# Altium schematic sheet 01_Power.SchDoc
size A3; Revision: A
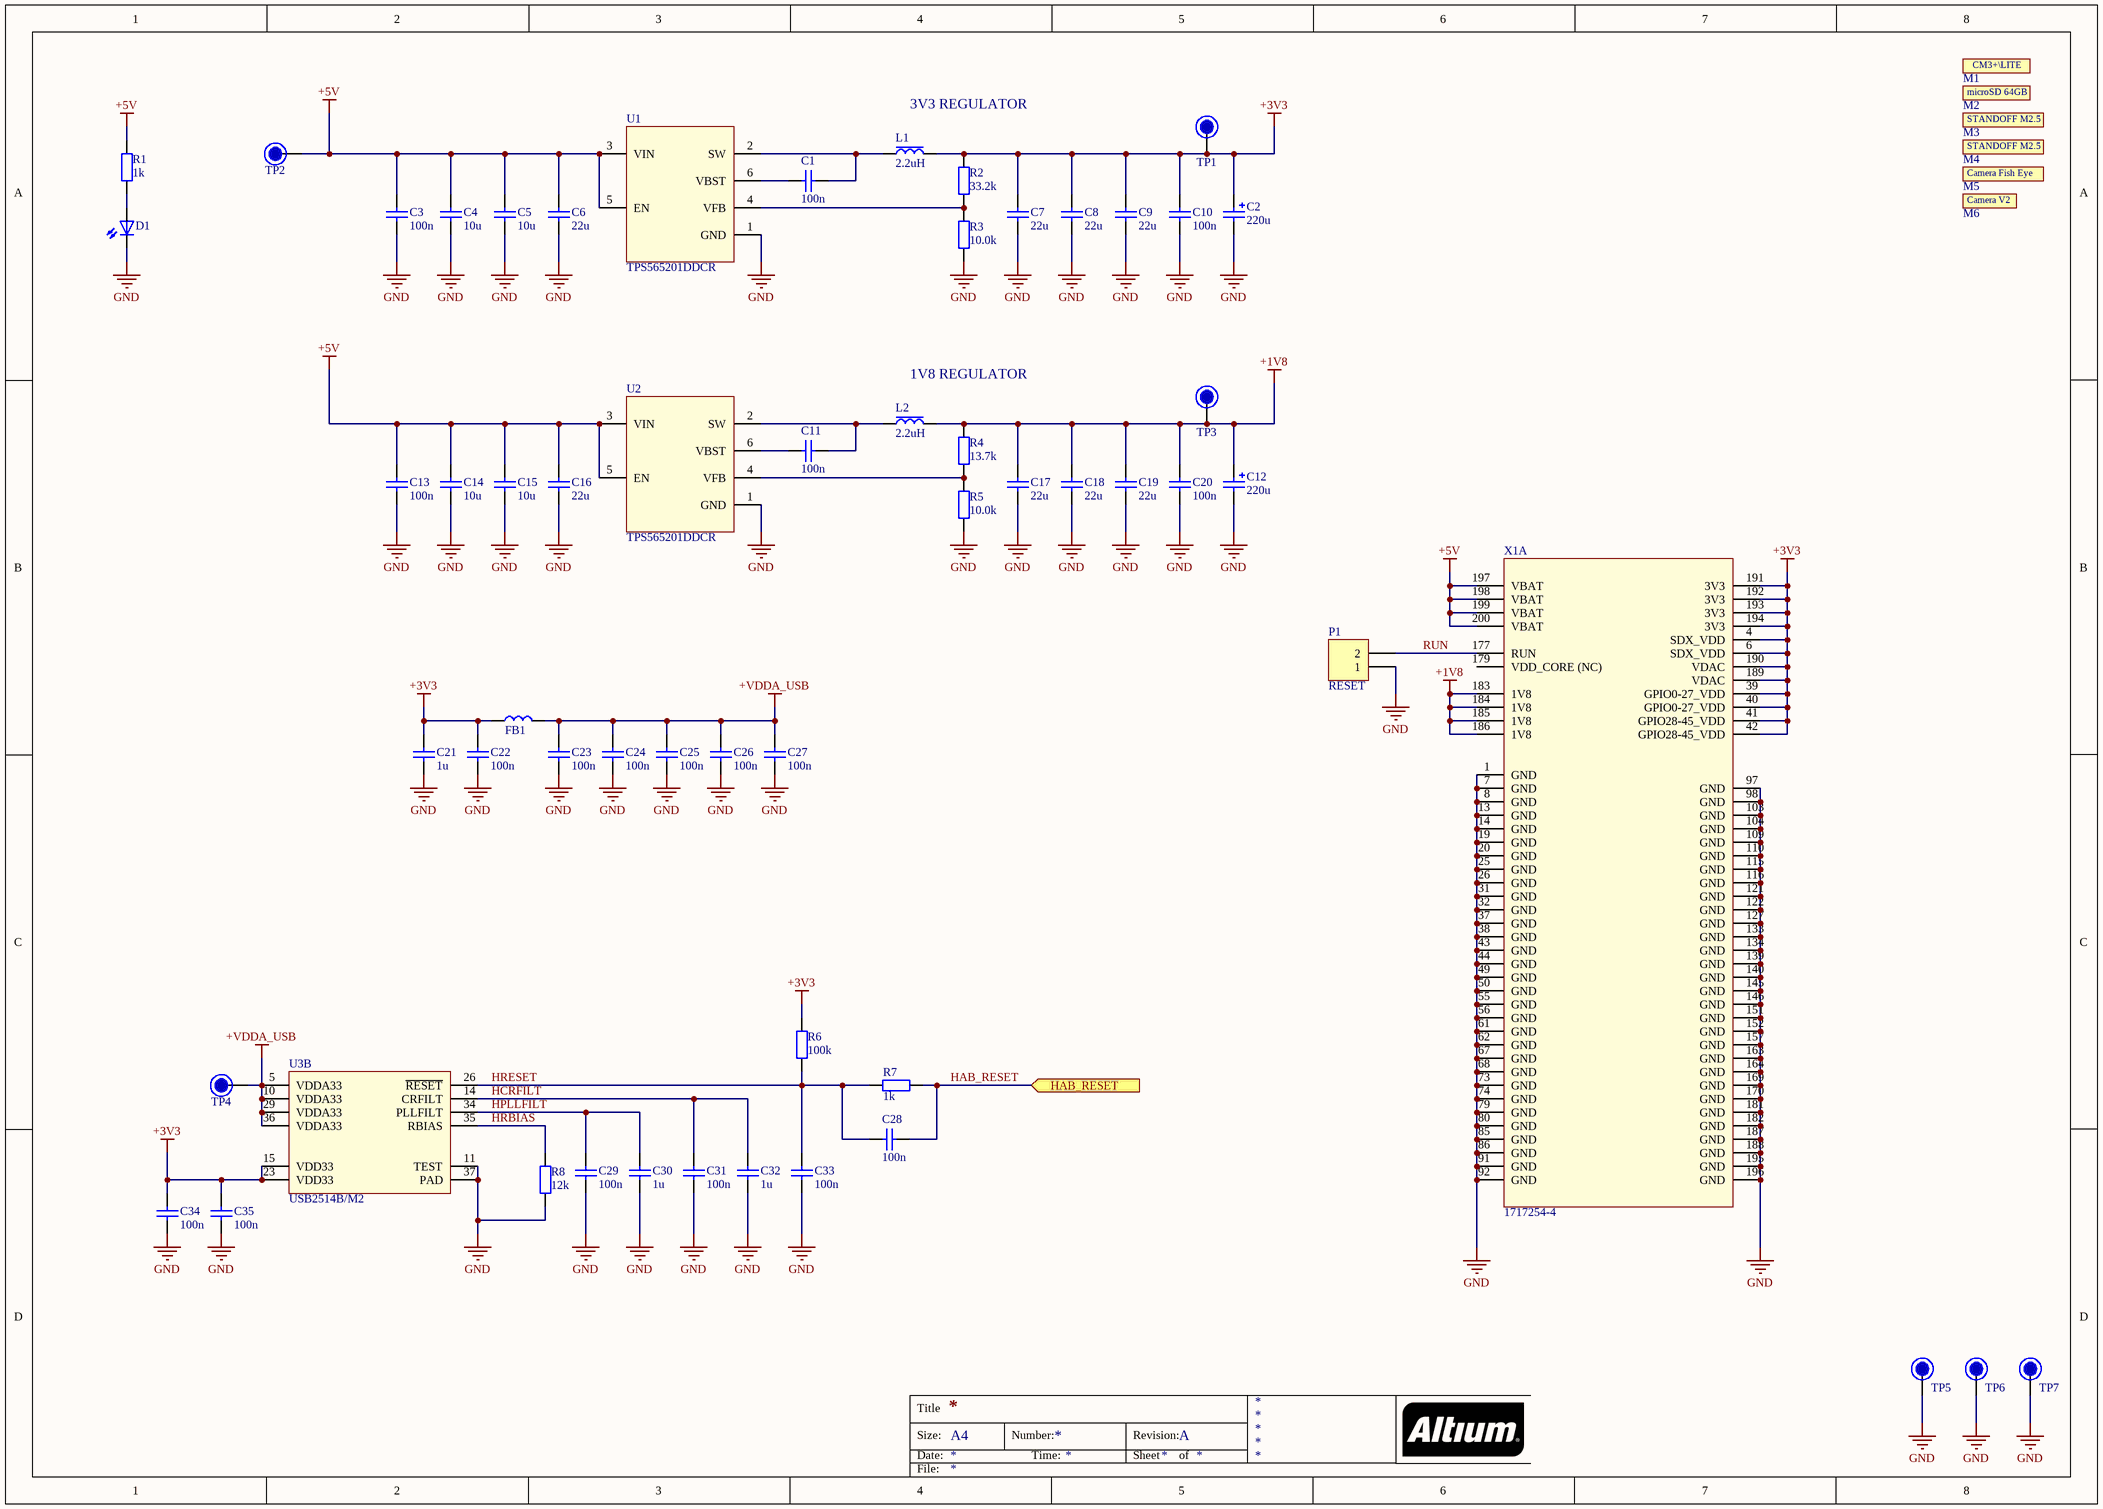
[diagram p0: 01_Power.SchDoc]

## Parts
C1  100n  [C0603_IPC_HD]
C2  220u  [TANT_CAP_7343]
C3  100n  [C0603_IPC_HD]
C4  10u  [C0805_IPC_HD]
C5  10u  [C0805_IPC_HD]
C6  22u  [C0805_IPC_HD]
C7  22u  [C0805_IPC_HD]
C8  22u  [C0805_IPC_HD]
C9  22u  [C0805_IPC_HD]
C10  100n  [C0603_IPC_HD]
C11  100n  [C0603_IPC_HD]
C12  220u  [TANT_CAP_7343]
C13  100n  [C0603_IPC_HD]
C14  10u  [C0805_IPC_HD]
C15  10u  [C0805_IPC_HD]
C16  22u  [C0805_IPC_HD]
C17  22u  [C0805_IPC_HD]
C18  22u  [C0805_IPC_HD]
C19  22u  [C0805_IPC_HD]
C20  100n  [C0603_IPC_HD]
C21  1u  [C0603_IPC_HD]
C22  100n  [C0603_IPC_HD]
C23  100n  [C0603_IPC_HD]
C24  100n  [C0603_IPC_HD]
C25  100n  [C0603_IPC_HD]
C26  100n  [C0603_IPC_HD]
C27  100n  [C0603_IPC_HD]
C28  100n  [C0603_IPC_HD]
C29  100n  [C0603_IPC_HD]
C30  1u  [C0603_IPC_HD]
C31  100n  [C0603_IPC_HD]
C32  1u  [C0603_IPC_HD]
C33  100n  [C0603_IPC_HD]
C34  100n  [C0603_IPC_HD]
C35  100n  [C0603_IPC_HD]
D1  LTST-C190GKT  [LED_0603]  (value not drawn)
FB1  MH1608-601Y  [L0603_IPC_MD]  (value not drawn)
L1  2.2uH  [ASPI-0520LR]
L2  2.2uH  [ASPI-0520LR]
M1  CM3+/LITE  (value not drawn)  (mechanical)
M2  SDCG2/­64GB  (value not drawn)  (mechanical)
M3  9774030151R  [9774030151R]  (value not drawn)
M4  9774030151R  [9774030151R]  (value not drawn)
M5  FishEye  (value not drawn)  (mechanical)
M6  913-2664  (value not drawn)  (mechanical)
P1  RESET  [HDR1X2]  (no BOM)
R1  1k  [R0603_IPC_MD]
R2  33.2k  [R0603_IPC_MD]
R3  10.0k  [R0603_IPC_MD]
R4  13.7k  [R0603_IPC_MD]
R5  10.0k  [R0603_IPC_MD]
R6  100k  [R0603_IPC_MD]
R7  1k  [R0603_IPC_MD]  (no BOM)
R8  12k  [R0603_IPC_MD]
TP1  3V3  [TestPoint_1M5]  (value not drawn)  (no BOM)
TP2  5V  [TestPoint_1M5]  (value not drawn)  (no BOM)
TP3  1V8  [TestPoint_1M5]  (value not drawn)  (no BOM)
TP4  VDDA_USB  [TestPoint_1M5]  (value not drawn)  (no BOM)
TP5  Test Point  [TestPoint_1M5_TH]  (value not drawn)  (no BOM)
TP6  Test Point  [TestPoint_1M5_TH]  (value not drawn)  (no BOM)
TP7  Test Point  [TestPoint_1M5_TH]  (value not drawn)  (no BOM)
U1  TPS565201DDCR  [SOT23-6_(TI)]
U2  TPS565201DDCR  [SOT23-6_(TI)]
U3  USB2514B/M2  [QFN36]  (part B of 2)
X1  1717254-4  [1717254-1]  (part A of 7)

## Ports
HAB_RESET (in)

## Nets
+1V8: C12.1 C17.1 C18.1 C19.1 C20.1 L2.2 R4.2 TP3.0 X1.183(1V8) X1.184(1V8) X1.185(1V8) X1.186(1V8)
+3V3: C2.1 C7.1 C8.1 C9.1 C10.1 C21.2 C22.2 C34.2 C35.2 FB1.1 L1.2 R2.2 R6.2 TP1.0 U3.15(VDD33) U3.23(VDD33) X1.4(SDX_VDD) X1.6(SDX_VDD) X1.39(GPIO0-27_VDD) X1.40(GPIO0-27_VDD) X1.41(GPIO28-45_VDD) X1.42(GPIO28-45_VDD) X1.189(VDAC) X1.190(VDAC) X1.191(3V3) X1.192(3V3) X1.193(3V3) X1.194(3V3)
+5V: C3.1 C4.2 C5.2 C6.1 C13.1 C14.2 C15.2 C16.1 R1.2 TP2.0 U1.3(VIN) U1.5(EN) U2.3(VIN) U2.5(EN) X1.197(VBAT) X1.198(VBAT) X1.199(VBAT) X1.200(VBAT)
+VDDA_USB: C23.2 C24.2 C25.2 C26.2 C27.2 FB1.2 TP4.0 U3.5(VDDA33) U3.10(VDDA33) U3.29(VDDA33) U3.36(VDDA33)
GND: C2.2 C3.2 C4.1 C5.1 C6.2 C7.2 C8.2 C9.2 C10.2 C12.2 C13.2 C14.1 C15.1 C16.2 C17.2 C18.2 C19.2 C20.2 C21.1 C22.1 C23.1 C24.1 C25.1 C26.1 C27.1 C29.1 C30.1 C31.1 C32.1 C33.2 C34.1 C35.1 D1.1(C) P1.1 R3.1 R5.1 R8.1 TP5.0 TP6.0 TP7.0 U1.1(GND) U2.1(GND) U3.11(TEST) U3.37(PAD) X1.1(GND) X1.7(GND) X1.8(GND) X1.13(GND) X1.14(GND) X1.19(GND) X1.20(GND) X1.25(GND) X1.26(GND) X1.31(GND) X1.32(GND) X1.37(GND) X1.38(GND) X1.43(GND) X1.44(GND) X1.49(GND) X1.50(GND) X1.55(GND) X1.56(GND) X1.61(GND) X1.62(GND) X1.67(GND) X1.68(GND) X1.73(GND) X1.74(GND) X1.79(GND) X1.80(GND) X1.85(GND) X1.86(GND) X1.91(GND) X1.92(GND) X1.97(GND) X1.98(GND) X1.103(GND) X1.104(GND) X1.109(GND) X1.110(GND) X1.115(GND) X1.116(GND) X1.121(GND) X1.122(GND) X1.127(GND) X1.133(GND) X1.134(GND) X1.139(GND) X1.140(GND) X1.145(GND) X1.146(GND) X1.151(GND) X1.152(GND) X1.157(GND) X1.163(GND) X1.164(GND) X1.169(GND) X1.170(GND) X1.181(GND) X1.182(GND) X1.187(GND) X1.188(GND) X1.195(GND) X1.196(GND)
HAB_RESET: C28.1 R7.1 ; port HAB_RESET
HCRFILT: C31.2 C32.2 U3.14(CRFILT)
HPLLFILT: C29.2 C30.2 U3.34(PLLFILT)
HRBIAS: R8.2 U3.35(RBIAS)
HRESET: C28.2 C33.1 R6.1 R7.2 U3.26(~{RESET})
RUN: P1.2 X1.177(RUN)
NetC1_1: C1.1 L1.1 U1.2(SW)
NetC1_2: C1.2 U1.6(VBST)
NetC11_1: C11.1 L2.1 U2.2(SW)
NetC11_2: C11.2 U2.6(VBST)
NetD1_2: D1.2(A) R1.1
NetR2_1: R2.1 R3.2 U1.4(VFB)
NetR4_1: R4.1 R5.2 U2.4(VFB)

Not connected (* = marked no-connect by the designer): X1 179(VDD_CORE_(NC))

## Notes on the sheet
- 3V3 REGULATOR
- 1V8 REGULATOR
- Title
- Size:
- Date:
- A4
- Number:
- Time:
- Revision:
- Sheet
- of
- File:
- (in symbol CM3+/LITE) CM3+\LITE
- (in symbol SDCG2/64GB) microSD 64GB
- (in symbol STANDOFF_M2.5X0.45_3MM) STANDOFF M2.5

## Library data of the parts
C1 C3 C10 C11 C13 C20 C22-C29 C31 C33-C35 = CL10B104KO8NNNC: CAP CER 0.1UF 16V X7R 0603; Manufacturer: Samsung Electro-Mechanics; Manufacturer Part Number: CL10B104KO8NNNC; Voltage: 16V; Value: 100n; Dielectric: X7R; Supplier 1: Digi-Key; Supplier Part Number 1: 1276-1005-1-ND
C2 C12 = 6TPE220MI: Tantalum Capacitors 220uF 6.3V CASE-D_7343 RoHS; Manufacturer: PANASONIC; Manufacturer Part Number: 6TPE220MI; Value: 220u; Voltage: 6.3V; Supplier 1: LCSC; Supplier Part Number 1: C129173
C4 C5 C14 C15 = CL21B106KOQNNNG: CAP CER 10UF 16V X7R 0805; Manufacturer: Samsung Electro-Mechanics; Manufacturer Part Number: CL21B106KOQNNNG; Voltage: 16V; Value: 10u; Dielectric: X7R; Supplier 1: Digi-Key; Supplier Part Number 1: 1276-6472-1-ND
C6-C9 C16-C19 = CL21A226MOCLRNC: CAP CER 22UF 16V X5R 0805; Manufacturer: Samsung Electro-Mechanics; Manufacturer Part Number: CL21A226MOCLRNC; Voltage: 16V; Value: 22u; Dielectric: X5R; Supplier 1: Digi-Key; Supplier Part Number 1: 1276-6780-1-ND
C21 C30 C32 = CL10B105MO8NNWC: CAP CER 1UF 16V X7R 0603; Manufacturer: Samsung Electro-Mechanics; Manufacturer Part Number: CL10B105MO8NNWC; Voltage: 16V; Value: 1u; Dielectric: X7R; Supplier 1: Digi-Key; Supplier Part Number 1: 1276-6524-1-ND
D1 = LTST-C190GKT: LED GREEN CLEAR CHIP SMD 0603; Manufacturer: Lite-On Inc.; Manufacturer Part Number: LTST-C190GKT; Color: Green; Supplier 1: Digi-Key; Supplier Part Number 1: 160-1183-1-ND
FB1 = MH1608-601Y: FERRITE BEAD 600R@100MHz 0603 for Power Line, 1000mA; Manufacturer: Bourns Inc.; Manufacturer Part Number: MH1608-601Y; Supplier 1: Digi-Key; Supplier Part Number 1: MH1608-601YCT-ND
L1 L2 = ASPI-0520LR-2R2M-T2: FIXED IND 2.2UH 5.5A 36 MOHM SMD; Manufacturer: Abracon LLC; Manufacturer Part Number: ASPI-0520LR-2R2M-T2; Value: 2.2uH; Supplier 1: Digi-Key; Supplier Part Number 1: ASPI-0520LR-2R2M-T2CT-ND
M1 = CM3+/LITE: RASPBERRY PI COMPUTE 3+ LITE; Manufacturer: Raspberry Pi; Manufacturer Part Number: CM3+/LITE; Supplier 1: Aliexpress; Supplier Part Number 1: CM3+/LITE
M2 = SDCG2/64GB: MemoryCard Class 10, 64GB; Manufacturer: Kingston; Manufacturer Part Number: SDCG2/­64GB; Supplier 1: Pulser; Supplier Part Number 1: 148836
M3 M4 = STANDOFF_M2.5X0.45_3MM: RND STANDOFF M2.5X0.45 STEEL 3MM; Manufacturer: Würth Elektronik; Manufacturer Part Number: 9774030151R; Supplier 1: Digi-Key; Supplier Part Number 1: 732-7083-1-ND; Link: https://www.digikey.com/product-detail/en/w%C3%BCrth-elektronik/9774030151R/732-7083-1-ND/5320688
M5 = Camera Fish Eye: RASPBERRY PI CAMERA MODULE V2; Manufacturer: China; Manufacturer Part Number: FishEye; Supplier 1: Aliexpress; Supplier Part Number 1: FishEye
M6 = Camera V2: RASPBERRY PI CAMERA MODULE V2; Manufacturer: Raspberry Pi; Manufacturer Part Number: 913-2664; Supplier 1: Digi-Key; Supplier Part Number 1: 1690-1011-ND
P1 = Header 2: Header, 2-Pin; LatestRevisionDate: 17-Jul-2002; LatestRevisionNote: Re-released for DXP Platform.; Publisher: Altium Limited
R1 R7 = CR0603-JW-102ELF: RES SMD 1K OHM 5% 1/10W 0603; Manufacturer: Bourns Inc.; Value: 1k; Tolarance: 5%; Manufacturer Part Number: CR0603-JW-102ELF; Supplier 1: Digi-Key; Supplier Part Number 1: CR0603-JW-102ELFCT-ND
R2 = RMCF0603FT33K2: RES 33.2K OHM 1% 1/10W 0603; Manufacturer: Stackpole Electronics Inc; Value: 33.2k; Tolarance: 1%; Manufacturer Part Number: RMCF0603FT33K2; Supplier 1: Digi-Key; Supplier Part Number 1: RMCF0603FT33K2CT-ND
R3 R5 = RMCF0603FT10K0: RES 10K OHM 1% 1/10W 0603; Manufacturer: Stackpole Electronics Inc; Value: 10.0k; Tolarance: 1%; Manufacturer Part Number: RMCF0603FT10K0; Supplier 1: Digi-Key; Supplier Part Number 1: RMCF0603FT10K0CT-ND
R4 = RMCF0603FT13K7: RES 13.7K OHM 1% 1/10W 0603; Manufacturer: Stackpole Electronics Inc; Value: 13.7k; Tolarance: 1%; Manufacturer Part Number: RMCF0603FT13K7; Supplier 1: Digi-Key; Supplier Part Number 1: RMCF0603FT13K7CT-ND
R6 = RMCF0603FT100K: RES 100K OHM 1% 1/10W 0603; Manufacturer: Bourns Inc.; Value: 100k; Tolarance: 1%; Manufacturer Part Number: RMCF0603FT100K; Supplier 1: Digi-Key; Supplier Part Number 1: RMCF0603FT100KCT-ND
R8 = CR0603-FX-1202ELF: RES SMD 12K OHM 1% 1/10W 0603; Manufacturer: Bourns Inc.; Value: 12k; Tolarance: 1%; Manufacturer Part Number: CR0603-FX-1202ELF; Supplier 1: Digi-Key; Supplier Part Number 1: CR0603-FX-1202ELFCT-ND
TP1-TP4 = TP: Test Point
TP5-TP7 = TP
U1 U2 = TPS565201DDCR: Buck Switching Regulator IC Positive Adjustable 0.76V 1 Output 5A SOT-23-6 Thin, TSOT-23-6; Manufacturer: TI; Manufacturer Part Number: TPS565201DDCR; Supplier 1: Digi-Key; Supplier Part Number 1: 296-49006-1-ND
U3 = USB2514B/M2: IC HUB CTLR 4PORT USB 2.0 HS 36S; Manufacturer: Microchip Technology; Manufacturer Part Number: USB2514B/M2; Supplier 1: Digi-Key; Supplier Part Number 1: USB2514B/M2-ND
X1 = Raspberry CM Connector: CONN SKT SODIMM 200POS R/A SMD; Manufacturer: TE Connectivity AMP Connectors; Manufacturer Part Number: 1717254-4; Supplier 1: Digi-Key; Supplier Part Number 1: A130932CT-ND